# EAGLE design TICC3000WiFiBreakout (EAGLE 5.10)
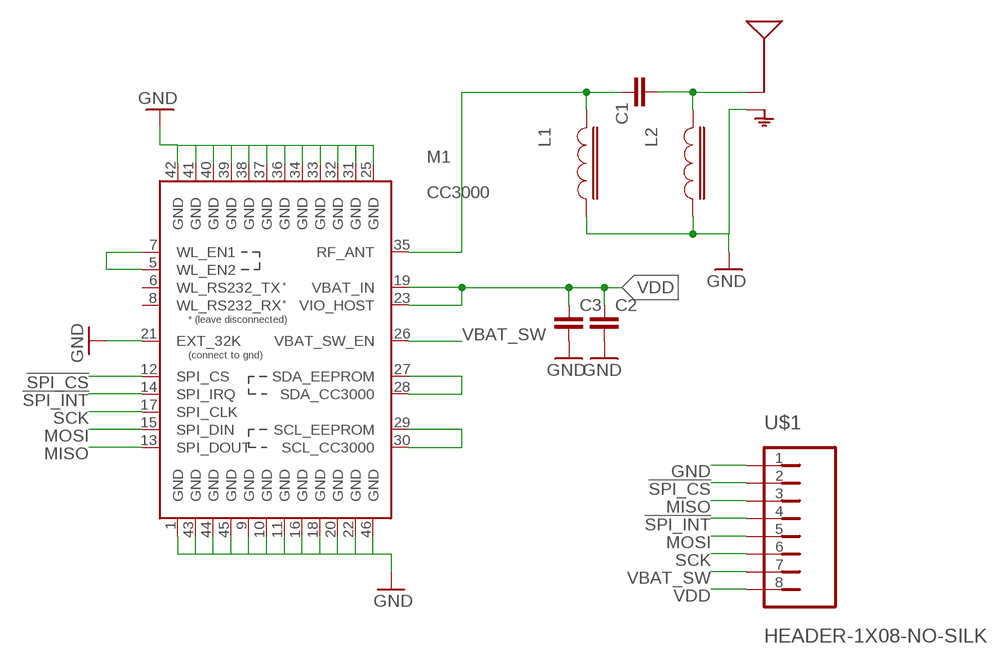
[diagram p0: schematic, sheet 1]

## Parts
ANT1  ANTENNA-TRACE-WITH-GND-2.450GHZ-TI-AN043  [ANTENNA-2.450GHZ-TI-AN043]
C1  CAP-0402-MIN  [0402-MIN]
C2  CAP-0805  [0805]
C3  CAP-0603-MIN  [0603-MIN]
L1  INDUCTOR-0402-MIN  [0402-MIN]
L2  INDUCTOR-0402-MIN  [0402-MIN]
M1  CC3000  TI-CC3000-WIFI-MODULE  [TI-CC3000-WIFI-MODULE]
U$1  HEADER-1X08-NO-SILK  [HEADER-1X08-NO-SILK]

## Nets
!SPI_CS: M1.12(SPI_CS) U$1.2
!SPI_INT: M1.14(SPI_IRQ) U$1.4
GND: ANT1.RFGND(GND) C2.1 C3.1 L1.2 L2.2 M1.1(GND) M1.9(GND) M1.10(GND) M1.11(GND) M1.16(GND) M1.18(GND) M1.20(GND) M1.21(EXT_32K) M1.22(GND) M1.25(GND) M1.31(GND) M1.32(GND) M1.33(GND) M1.34(GND) M1.36(GND) M1.37(GND) M1.38(GND) M1.39(GND) M1.40(GND) M1.41(GND) M1.42(GND) M1.43(GND) M1.44(GND) M1.45(GND) M1.46(GND) U$1.1
MISO: M1.13(SPI_DOUT) U$1.3
MOSI: M1.15(SPI_DIN) U$1.5
N$1: M1.27(SDA_EEPROM) M1.28(SDA_CC3000)
N$2: M1.29(SCL_EEPROM) M1.30(SCL_CC3000)
N$3: M1.5(WL_EN2) M1.7(WL_EN1)
N$5: C1.2 L1.1 M1.35(RF_ANT)
N$6: ANT1.ANT(RF) C1.1 L2.1
SCK: M1.17(SPI_CLK) U$1.6
VBAT_SW: M1.26(VBAT_SW_EN) U$1.7
VDD: C2.2 C3.2 M1.19(VBAT_IN) M1.23(VIO_HOST) U$1.8
Unconnected: M1.6(WL_RS232_TX) M1.8(WL_RS232_RX)

## Library data of the parts
ANT1 = Outbreak:ANTENNA-TRACE-WITH-GND
C1-C3 = Outbreak:CAP
L1 L2 = Outbreak:INDUCTOR
M1 = Outbreak:TI-CC3000-WIFI-MODULE
U$1 = Outbreak:HEADER-1X08-NO-SILK

## Board
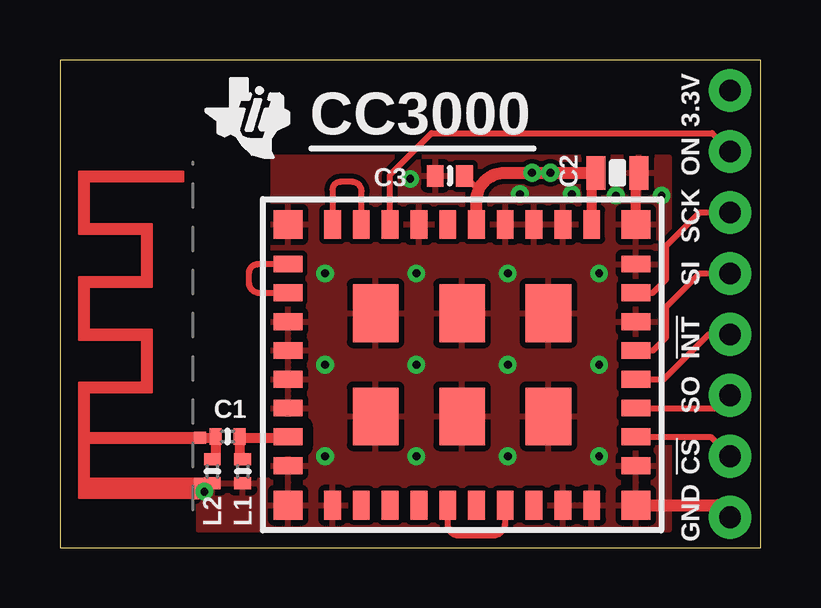
[diagram p1: board, top side]
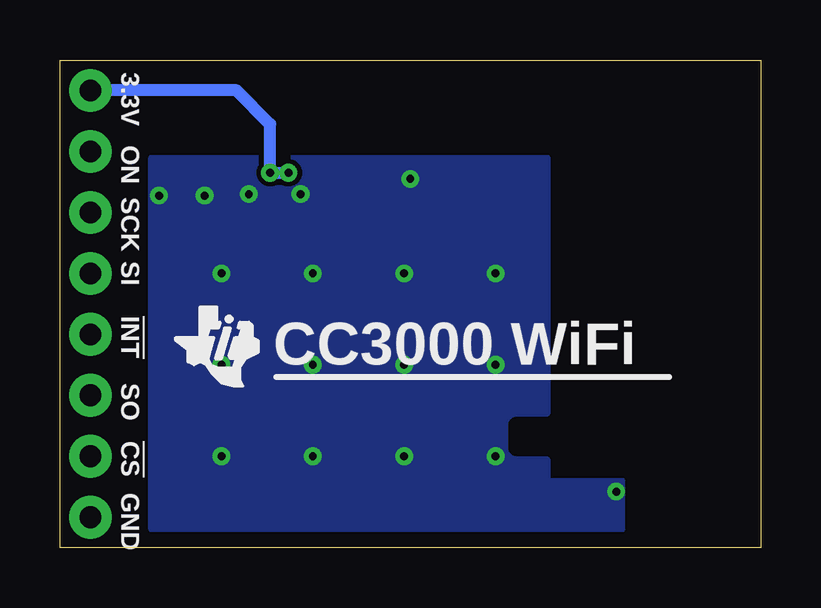
[diagram p2: board, bottom side, seen from below]

Size 29.21 x 20.32 mm. Coordinates in mm from the lower left corner, seen from the top.
Outline: 0,0 29.21,0 29.21,20.32 0,20.32 0,0
Copper layers (1*16): Top 0.035mm / dielectric 1.5mm / Bottom 0.035mm
Design rules "default *": minimum track width 6mil, minimum drill 13mil, track to track 8mil, track to pad 8mil, pad to pad 8mil, via to via 8mil, smd to smd 8mil, copper to edge 10mil, drill to drill 8mil, minimum pad ring 10mil, minimum via ring 8mil, stop-mask expansion 4mil, vias tented up to drill 20mil, thermal gap 10mil

### Footprints (pad centres in the part's own frame; a part is rotated, then mirrored left to right if it is on the bottom)
ANTENNA-2.450GHZ-TI-AN043 = smd 0.5 x 0.5: ANT 0,0 | smd 0.9 x 0.5: RFGND -2.1,0
0402-MIN = smd 0.5 x 0.7: 1 -0.5,0; 2 0.5,0
0805 = smd 0.8 x 1.397: 1 -0.9,0; 2 0.9,0
0603-MIN = smd 0.7 x 0.9: 1 -0.61,0; 2 0.61,0
TI-CC3000-WIFI-MODULE = smd 1.2 x 0.7: 1 -5.85,5.4; 2 -5.85,4.2; 3 -5.85,3; 4 -5.85,1.8; 5 -5.85,0.6; 6 -5.85,-0.6; 7 -5.85,-1.8; 8 -5.85,-3; 9 -5.85,-4.2; 10 -5.85,-5.4; 19 5.85,-5.4; 20 5.85,-4.2; 21 5.85,-3; 22 5.85,-1.8; 23 5.85,-0.6; 24 5.85,0.6; 25 5.85,1.8; 26 5.85,3; 27 5.85,4.2; 28 5.85,5.4 | smd 0.7 x 1.2: 11 -4.2,-7.25; 12 -3,-7.25; 13 -1.8,-7.25; 14 -0.6,-7.25; 15 0.6,-7.25; 16 1.8,-7.25; 17 3,-7.25; 18 4.2,-7.25; 29 4.2,7.25; 30 3,7.25; 31 1.8,7.25; 32 0.6,7.25; 33 -0.6,7.25; 34 -1.8,7.25; 35 -3,7.25; 36 -4.2,7.25 | smd 2.4 x 1.9: 37 -2.15,3.6; 38 -2.15,0; 39 -2.15,-3.6; 40 2.15,3.6; 41 2.15,0; 42 2.15,-3.6 | smd 1.2 x 1.2: 43 -5.85,7.25; 44 -5.85,-7.25; 45 5.85,-7.25; 46 5.85,7.25
HEADER-1X08-NO-SILK = drill 0.9 pad 1.778 round: 1 -8.89,0; 2 -6.35,0; 3 -3.81,0; 4 -1.27,0; 5 1.27,0; 6 3.81,0; 7 6.35,0; 8 8.89,0

### Placement (x,y rotation side)
ANT1  5.84,4.57 90 top
C1  6.99,4.64 0 top
C2  23.24,15.62 180 top
C3  16.26,15.49 0 top
L1  7.62,3.17 270 top
L2  6.35,3.17 270 top
M1  16.76,7.62 90 top
U$1  27.94,10.16 90 top

### Tracks (layer width: path | path; a pad name or v marks a point on that pad's centre or on a via)
!SPI_CS
  Top 0.254: M1.12 27.13,4.62 U$1.2
!SPI_INT
  Top 0.254: M1.14 25.18,7.02 27.05,8.89 U$1.4
GND  (via drill 0.33)
  Top 0.254: 6.02,2.42 5.97,2.47 ANT1.RFGND
  Top 0.406: C2.1 24.01,15.62 M1.45
  Top 0.508: v6.02,2.34 6.02,2.42 L2.2 | M1.44 27.44,1.77 U$1.1
  other vias: 11.05,11.43 11.05,7.62 11.05,3.81 14.86,3.81 14.86,7.62 14.86,11.43 18.67,11.43 18.67,7.62 18.67,3.81 22.48,3.81 22.48,7.62 22.48,11.43 19.18,14.73 21.34,14.73 25.08,14.67 23.18,14.67 14.61,15.37
  pour Bottom: 25.4,16.26 8.89,16.26 8.89,5.59 10.16,5.59 arc-90 10.67,5.08 10.67,4.19 arc-90 10.16,3.68 8.89,3.68 8.89,2.79 5.78,2.79 5.78,0.76 25.4,0.76
  pour Top: 25.4,16.26 8.89,16.26 8.89,5.59 10.16,5.59 arc-90 10.67,5.08 10.67,4.19 arc-90 10.16,3.68 8.89,3.68 8.89,2.79 5.78,2.79 5.78,0.76 25.4,0.76
MISO
  Top 0.254: M1.13 27.41,5.82 U$1.3
MOSI
  Top 0.254: M1.15 24.73,8.22 25.27,8.76 25.27,10.03 26.67,11.43 U$1.5
N$1
  Top 0.254: M1.28 11.36,14.92 arc-90 11.68,15.24 12.19,15.24 arc-90 12.57,14.86 12.57,13.48 arc-90 M1.27
N$2
  Top 0.254: M1.30 8.3,10.62 arc-90 7.87,11.05 7.87,11.43 arc-90 8.26,11.81 M1.29 arc90 M1.29
N$3
  Top 0.254: M1.5 16.16,0.98 arc90 16.64,0.51 18.03,0.51 arc90 18.56,1.04 M1.7
N$5
  Top 0.406: M1.35 9.51,4.57 7.49,4.57 C1.2 7.49,3.67 L1.1
N$6
  Top 0.406: ANT1.ANT 6.49,4.57 C1.1 6.49,3.67 L2.1
SCK
  Top 0.254: M1.17 24.72,10.62 25.27,11.18 25.27,12.57 26.67,13.97 U$1.6
VBAT_SW
  Top 0.254: M1.26 13.76,15.54 15.49,17.27 27.18,17.27 U$1.7
VDD  (via drill 0.33)
  Top 0.254: C3.2 17.36,15 17.36,14.44
  Top 0.406: C2.2 22.16,15.62 M1.19
  Top 0.508: M1.23 17.36,14.44 arc-90 18.54,15.62 v20.45,15.62 C2.2
  Bottom 0.508: U$1.8 21.84,19.05 20.45,17.65 v20.45,15.62 v19.68,15.62

### Text on the board
tPlace: 3.3V | ON | SCK | SI | !INT | SO | !CS | GND
bPlace: 3.3V | ON | SCK | SI | !INT | CC3000 WiFi | SO | !CS | GND